# Altium schematic sheet DC-DC TPS65133.schdoc
size A2
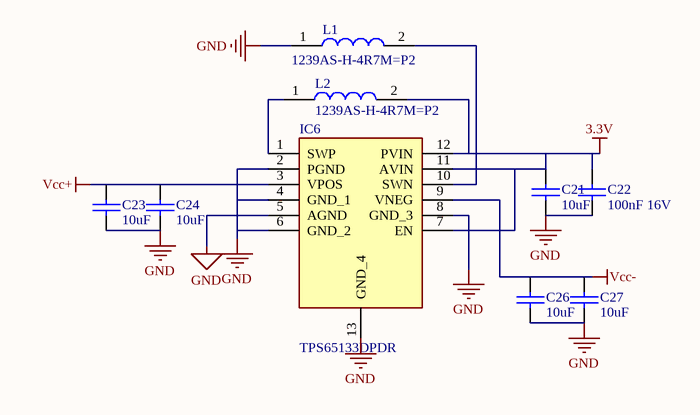
[diagram p0: DC-DC TPS65133.schdoc]

## Parts
C21  10uF  [0603C]
C22  100nF 16V  [0402C]
C23  10uF  [0603C]
C24  10uF  [0603C]
C26  10uF  [0603C]
C27  10uF  [0603C]
IC6  TPS65133DPDR  [SON45P300X300X80-13N-D]
L1  1239AS-H-4R7M=P2  [DFE2HCAH1R0MJ0L]
L2  1239AS-H-4R7M=P2  [DFE2HCAH1R0MJ0L]

## Nets
3.3V: C21.1 C22.2 IC6.7(EN) IC6.11(AVIN) IC6.12(PVIN) L2.2
GND: C21.2 C22.1 C23.2 C24.2 C26.2 C27.2 IC6.2(PGND) IC6.4(GND_1) IC6.5(AGND) IC6.6(GND_2) IC6.8(GND_3) IC6.13(GND_4) L1.1
Vcc+: C23.1 C24.1 IC6.3(VPOS)
Vcc-: C26.1 C27.1 IC6.9(VNEG)
NetIC6_1: IC6.1(SWP) L2.1
NetIC6_10: IC6.10(SWN) L1.2

## Library data of the parts
C21 C23 C24 C26 C27 = CAP-NP
C22 = CAP-NP: Manufacturer 1: Samsung; Manufacturer Part Number 1: CL05B104KO5NNNC; Description 1: CAP CER 0.1UF 16V X7R 0402; Material: Ceramic; Tolerance: 10%; Dielectric: X7R; Supplier 1: LCSC; Supplier Part Number 1: C1525; Stock 1: 5012200; Pricing 1: 100=0.0023, 1000=0.002, 3000=0.0018, 10000=0.0017, 50000=0.0017, 100000=0.0017, 100=0.0021, 1000=0.0018, 3000=0.0017, 10000=0.0016, 50000=0.0016, 100000=0.0016, 100=0.0107, 1000=0.0094, 3000=0.0087, 10000=0.008, 50000=0.008, 100000=0.008, 100=0.0102, 1000=0.0089, 3000=0.0083, 10000=0.0077, 50000=0.0077, 100000=0.0077, 100=0.0014, 1000=0.0012, 3000=0.0011, 10000=0.001, 50000=0.001, 100000=0.001, 100=0.0012, 1000=0.0011, 3000=0.001, 10000=0.0009, 50000=0.0009, 100000=0.0009, 100=0.0124, 1000=0.0109, 3000=0.0101, 10000=0.0093, 50000=0.0093, 100000=0.0093, 100=0.1676, 1000=0.1466, 3000=0.1361, 10000=0.1257, 50000=0.1257, 100000=0.1257, 100=0.0066, 1000=0.0058, 3000=0.0054, 10000=0.005, 50000=0.005, 100000=0.005, 100=0.1289, 1000=0.1128, 3000=0.1048, 10000=0.0967, 50000=0.0967, 100000=0.0967, 100=0.0142, 1000=0.0125, 3000=0.0116, 10000=0.0107, 50000=0.0107, 100000=0.0107, 100=0.0022, 1000=0.0019, 3000=0.0018, 10000=0.0016, 50000=0.0016, 100000=0.0016, 100=0.0016, 1000=0.0014, 3000=0.0013, 10000=0.0012, 50000=0.0012, 100000=0.0012 (AUD); Mount: Surface Mount; Case/Package: 0402; Case Code (Metric): 1005; Case Code (Imperial): 0402; Contact Plating: Tin; Min Operating Temperature: -55°C; Max Operating Temperature: 125°C; Capacitance: 100nF; Packaging: Tape and Reel; Voltage Rating: 16V; Voltage Rating (DC): 16V; Package Quantity: 1; Voltage: 16V; Length: 1mm; Width: 0.02inch; Height 1: 0.5mm; Thickness: 0.022inch; Depth: 0.5mm; Radiation Hardening: No; Lead Free: Lead Free; ComponentLink1URL: http://www1.futureelectronics.com/doc/SAMSUNG%20PASSIVE/CL05B104KQ5NNNC.pdf?src-supplier=Future+Electronics; ComponentLink1Description: http://www1.futureelectronics.com/doc/SAMSUNG%20PASSIVE/CL05B104KQ5NNNC.pdf?src-supplier=Future+Electronics; ComponentLink2URL: https://www.verical.com/server-webapp/html/getDatasheet?partID=359683&src-supplier=Verical; ComponentLink2Description: https://www.verical.com/server-webapp/html/getDatasheet?partID=359683&src-supplier=Verical; ComponentLink3URL: https://www.distrelec.biz/Web/Downloads/_e/ng/MLCC_CatalogDownload2013_ENG.pdf?mime=application%2Fpdf&src-supplier=Distrelec; ComponentLink3Description: https://www.distrelec.biz/Web/Downloads/_e/ng/MLCC_CatalogDownload2013_ENG.pdf?mime=application%2Fpdf&src-supplier=Distrelec; ComponentLink4URL: https://produktinfo.conrad.com/datenblaetter/450000-474999/458718-da-01-en-VS_KONDENSATOR_0402.pdf?src-supplier=Conrad; ComponentLink4Description: https://produktinfo.conrad.com/datenblaetter/450000-474999/458718-da-01-en-VS_KONDENSATOR_0402.pdf?src-supplier=Conrad
IC6 = TPS65133DPDR: Integrated Circuit; Manufacturer_Name: Texas Instruments; Datasheet Link: http://www.ti.com/lit/ds/symlink/tps65133.pdf; Height: 0.8mm; Manufacturer_Part_Number: TPS65133DPDR; Arrow Part Number: TPS65133DPDR; Arrow Price/Stock: https://www.arrow.com/en/products/tps65133dpdr/texas-instruments; Mouser Part Number: 595-TPS65133DPDR; Mouser Price/Stock: https://www.mouser.co.uk/ProductDetail/Texas-Instruments/TPS65133DPDR?qs=7GxONfNUZSjxiorxR5wfmg%3D%3D
L1 L2 = 1239AS-H-4R7M=P2: Inductor; Manufacturer_Name: Murata Electronics; Datasheet Link: https://psearch.en.murata.com/inductor/product/1239AS-H-4R7M%23.html; Height: 1.2mm; Manufacturer_Part_Number: 1239AS-H-4R7M=P2; Arrow Part Number: 1239AS-H-4R7M=P2; Arrow Price/Stock: https://www.arrow.com/en/products/1239as-h-4r7mp2/murata-manufacturing; Mouser Part Number: 81-1239AS-H-4R7MP2; Mouser Price/Stock: https://www.mouser.co.uk/ProductDetail/Murata-Electronics/1239AS-H-4R7M%3dP2?qs=KuGPmAKtFKX7SH37MciNXQ%3D%3D